# Altium schematic sheet Power.SchDoc
size A
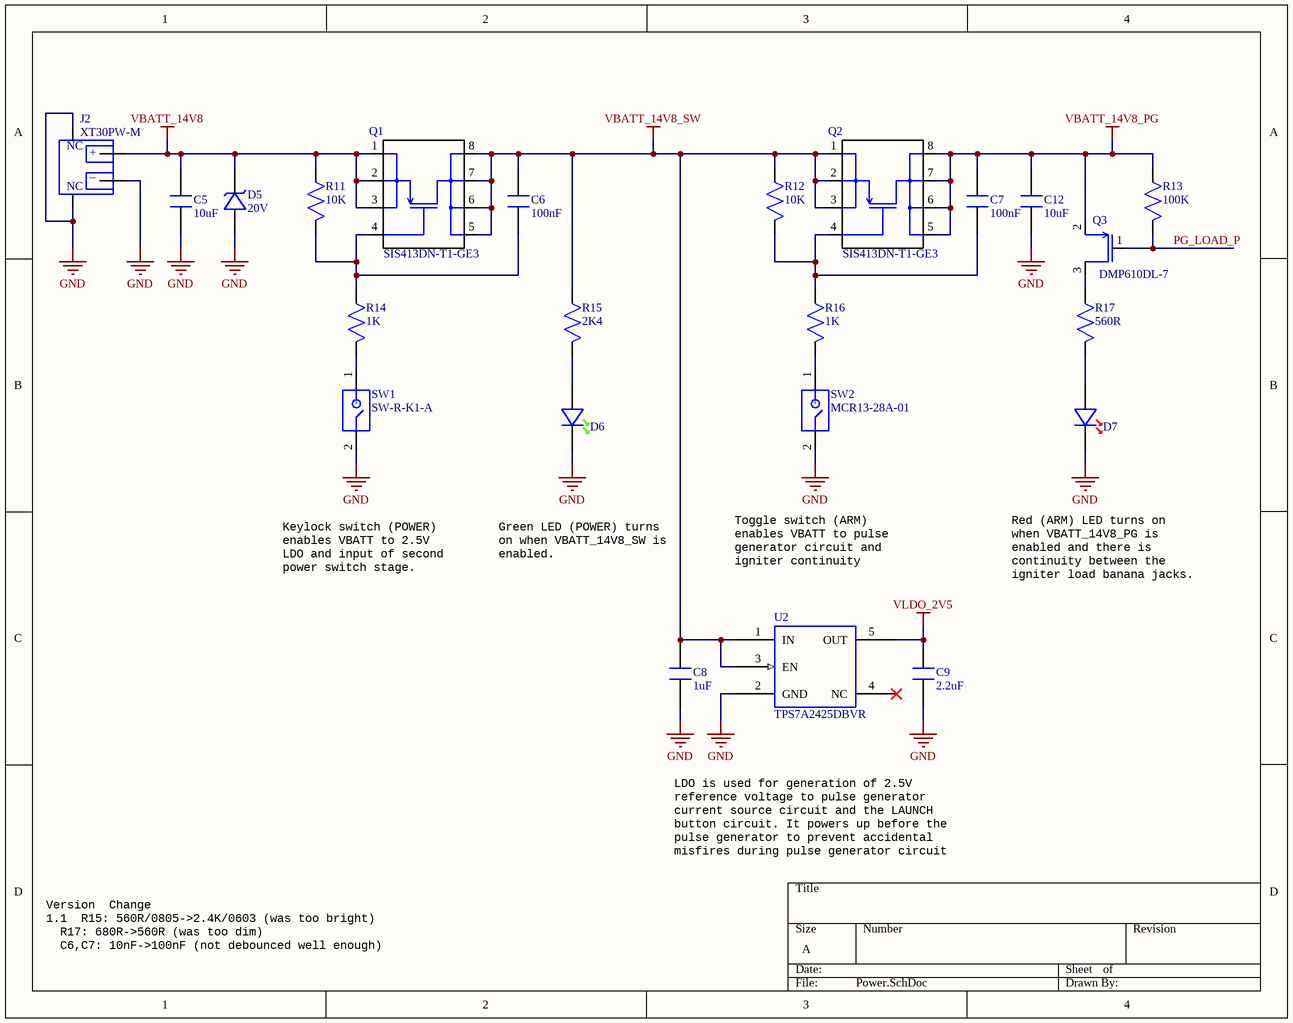
[diagram p0: Power.SchDoc]

## Parts
C5  Capacitance: 10uF  [1206_CAP]
C6  Capacitance: 100nF  [0603_CAP]  (hidden comment: CAP_0603_100nF)
C7  Capacitance: 100nF  [0603_CAP]  (hidden comment: CAP_0603_100nF)
C8  Capacitance: 1uF  [0603_CAP]
C9  Capacitance: 2.2uF  [0603_CAP]
C12  Capacitance: 10uF  [1206_CAP]
D5  Reverse Standoff Voltage: 20V  [DO-214AC_SMA]  (hidden comment: *)
D6  *  [LED_1411]  (value not drawn)
D7  *  [LED_1411]  (value not drawn)
J2  Part Number: XT30PW-M  [CONN_PLUG_XT30PW-M]
Q1  Part Number: SIS413DN-T1-GE3  [PFET_POWERPAK_1212-8]  (hidden comment: *)
Q2  Part Number: SIS413DN-T1-GE3  [PFET_POWERPAK_1212-8]  (hidden comment: *)
Q3  Part Number: DMP610DL-7  [SOT-23-3]  (hidden comment: *)
R11  Resistance: 10K  [0603_RES]
R12  Resistance: 10K  [0603_RES]
R13  Resistance: 100K  [0603_RES]
R14  Resistance: 1K  [0603_RES]
R15  Resistance: 2K4  [0603_RES]  (hidden comment: RES_0603_2K4)
R16  Resistance: 1K  [0603_RES]
R17  Resistance: 560R  [0805_RES]  (hidden comment: RES_0805_560R)
SW1  Part Number: SW-R-K1-A  [SW_KEYLOCK_SW-R-K1-A]  (hidden comment: *)
SW2  Part Number: MCR13-28A-01  [SW_TOGGLE_MCR13-28A-01]  (hidden comment: *)
U2  TPS7A2425DBVR  [SOT-23-5]

## Nets
GND: C5.1 C8.1 C9.1 C12.1 D5.2 D6.1 D7.1 J2.2 SW1.2 SW2.2 U2.2(GND)
VBATT_14V8: C5.2 D5.1 J2.1 Q1.1(S) Q1.2(S) Q1.3(S) R11.2
VBATT_14V8_PG: C7.2 C12.2 Q2.5(D) Q2.6(D) Q2.7(D) Q2.8(D) Q3.2(S) R13.2
VBATT_14V8_SW: C6.2 C8.2 Q1.5(D) Q1.6(D) Q1.7(D) Q1.8(D) Q2.1(S) Q2.2(S) Q2.3(S) R12.2 R15.2 U2.1(IN) U2.3(EN)
VLDO_2V5: C9.2 U2.5(OUT)
PG_LOAD_P: Q3.1(G) R13.1
NetC6_1: C6.1 Q1.4(G) R11.1 R14.2
NetC7_1: C7.1 Q2.4(G) R12.1 R16.2
NetD6_2: D6.2 R15.1
NetD7_2: D7.2 R17.1
NetQ3_3: Q3.3(D) R17.2
NetR14_1: R14.1 SW1.1
NetR16_1: R16.1 SW2.1

Not connected (* = marked no-connect by the designer): U2 4(NC)*

## Notes on the sheet
- Keylock switch (POWER) enables VBATT to 2.5V LDO and input of second power switch stage.
- Green LED (POWER) turns on when VBATT_14V8_SW is enabled.
- Toggle switch (ARM) enables VBATT to pulse generator circuit and igniter continuity checker.
- Red (ARM) LED turns on when VBATT_14V8_PG is enabled and there is continuity between the igniter load banana jacks.
- LDO is used for generation of 2.5V reference voltage to pulse generator current source circuit and the LAUNCH button circuit. It powers up before the pulse generator to prevent accidental misfires during pulse generator circuit startup.
- Version		Change
  1.1		R15: 560R/0805->2.4K/0603 (was too bright)
  R17: 680R->560R (was too dim)
  C6,C7: 10nF->100nF (not debounced well enough)
- (in symbol CONN_PLUG_XT30PW-M) NC; +; _

## Library data of the parts
C5 C12 = CAP_1206_10uF: Manufacturer: Samsung Electro-Mechanics; Part Number: CL31A106MBHNNNE; Tolerance: 20%; Voltage: 50V; Dielectric: X5R
C6 C7 = CAP_0603_100nF: Manufacturer: Samsung Electro-Mechanics; Part Number: CL10B104KB8NNWC; Tolerance: 10%; Voltage: 50V; Dielectric: X7R
C8 = CAP_0603_1uF: Manufacturer: Samsung Electro-Mechanics; Part Number: CL10B105KA8NNNC; Tolerance: 10%; Voltage: 25V; Dielectric: X7R
C9 = CAP_0603_2.2uF: Manufacturer: Samsung Electro-Mechanics; Part Number: CL10B225KP8NNNC; Tolerance: 10%; Voltage: 10V; Dielectric: X7R
D5 = DIODE_TVS_20V_UNIDIR: Manufacturer: Diodes Incorporated; Part Number: SMAJ20AQ-13-F; Package: DO-214AC_SMA
D6 = LED_GREEN_150141GS73100: Manufacturer: Würth Elektronik; Part Number: 150141GS73100; Package: SMD 1411
D7 = LED_RED_150141RS73100: Manufacturer: Würth Elektronik; Part Number: 150141RS73100; Package: SMD 1411
J2 = CONN_PLUG_XT30PW-M: Manufacturer: AMASS
Q1 Q2 = PFET_SIS413DN: Manufacturer: Vishay Siliconix; Package: PowerPAK® 1212-8
Q3 = PFET_DMP610DL: Manufacturer: Diodes Incorporated; Package: SOT-23-3
R11 R12 = RES_0603_10K: Manufacturer: Stackpole Electronics Inc; Part Number: RMCF0603FT10K0; Tolerance: 1%; Temperature Coefficient: 100ppm; Power Rating: 0.1W
R13 = RES_0603_100K: Manufacturer: Stackpole; Part Number: RMCF0603FT100K; Tolerance: 1%; Temperature Coefficient: 100ppm; Power Rating: 0.1W
R14 R16 = RES_0603_1K: Manufacturer: Stackpole Electronics Inc; Part Number: RMCF0603FT1K00; Temperature Coefficient: 100ppm; Tolerance: 1%; Power Rating: 0.1W
R15 = RES_0603_2K4: Manufacturer: Stackpole Electronics Inc; Part Number: RMCF0603FT2K40; Tolerance: 1%; Power Rating: 0.1W; Temperature Coefficient: 100ppm
R17 = RES_0805_560R: Manufacturer: Vishay Dale; Part Number: CRCW0805560RFKEAHP; Tolerance: 1%; Power Rating: 0.5W; Temperature Coefficient: 100ppm
SW1 = SW_KEYLOCK_SW-R-K1-A: Manufacturer: Adam Tech
SW2 = SW_TOGGLE_MCR13-28A-01: Manufacturer: Multicomp
U2 = TPS7A2425DBVR: Manufacturer: Texas Instruments; Package: SOT-23-5; Part Number: TPS7A2425DBVR